# Altium schematic sheet 12_fit_YX.SchDoc
size B; SheetNumber: 1; SheetTotal: 3
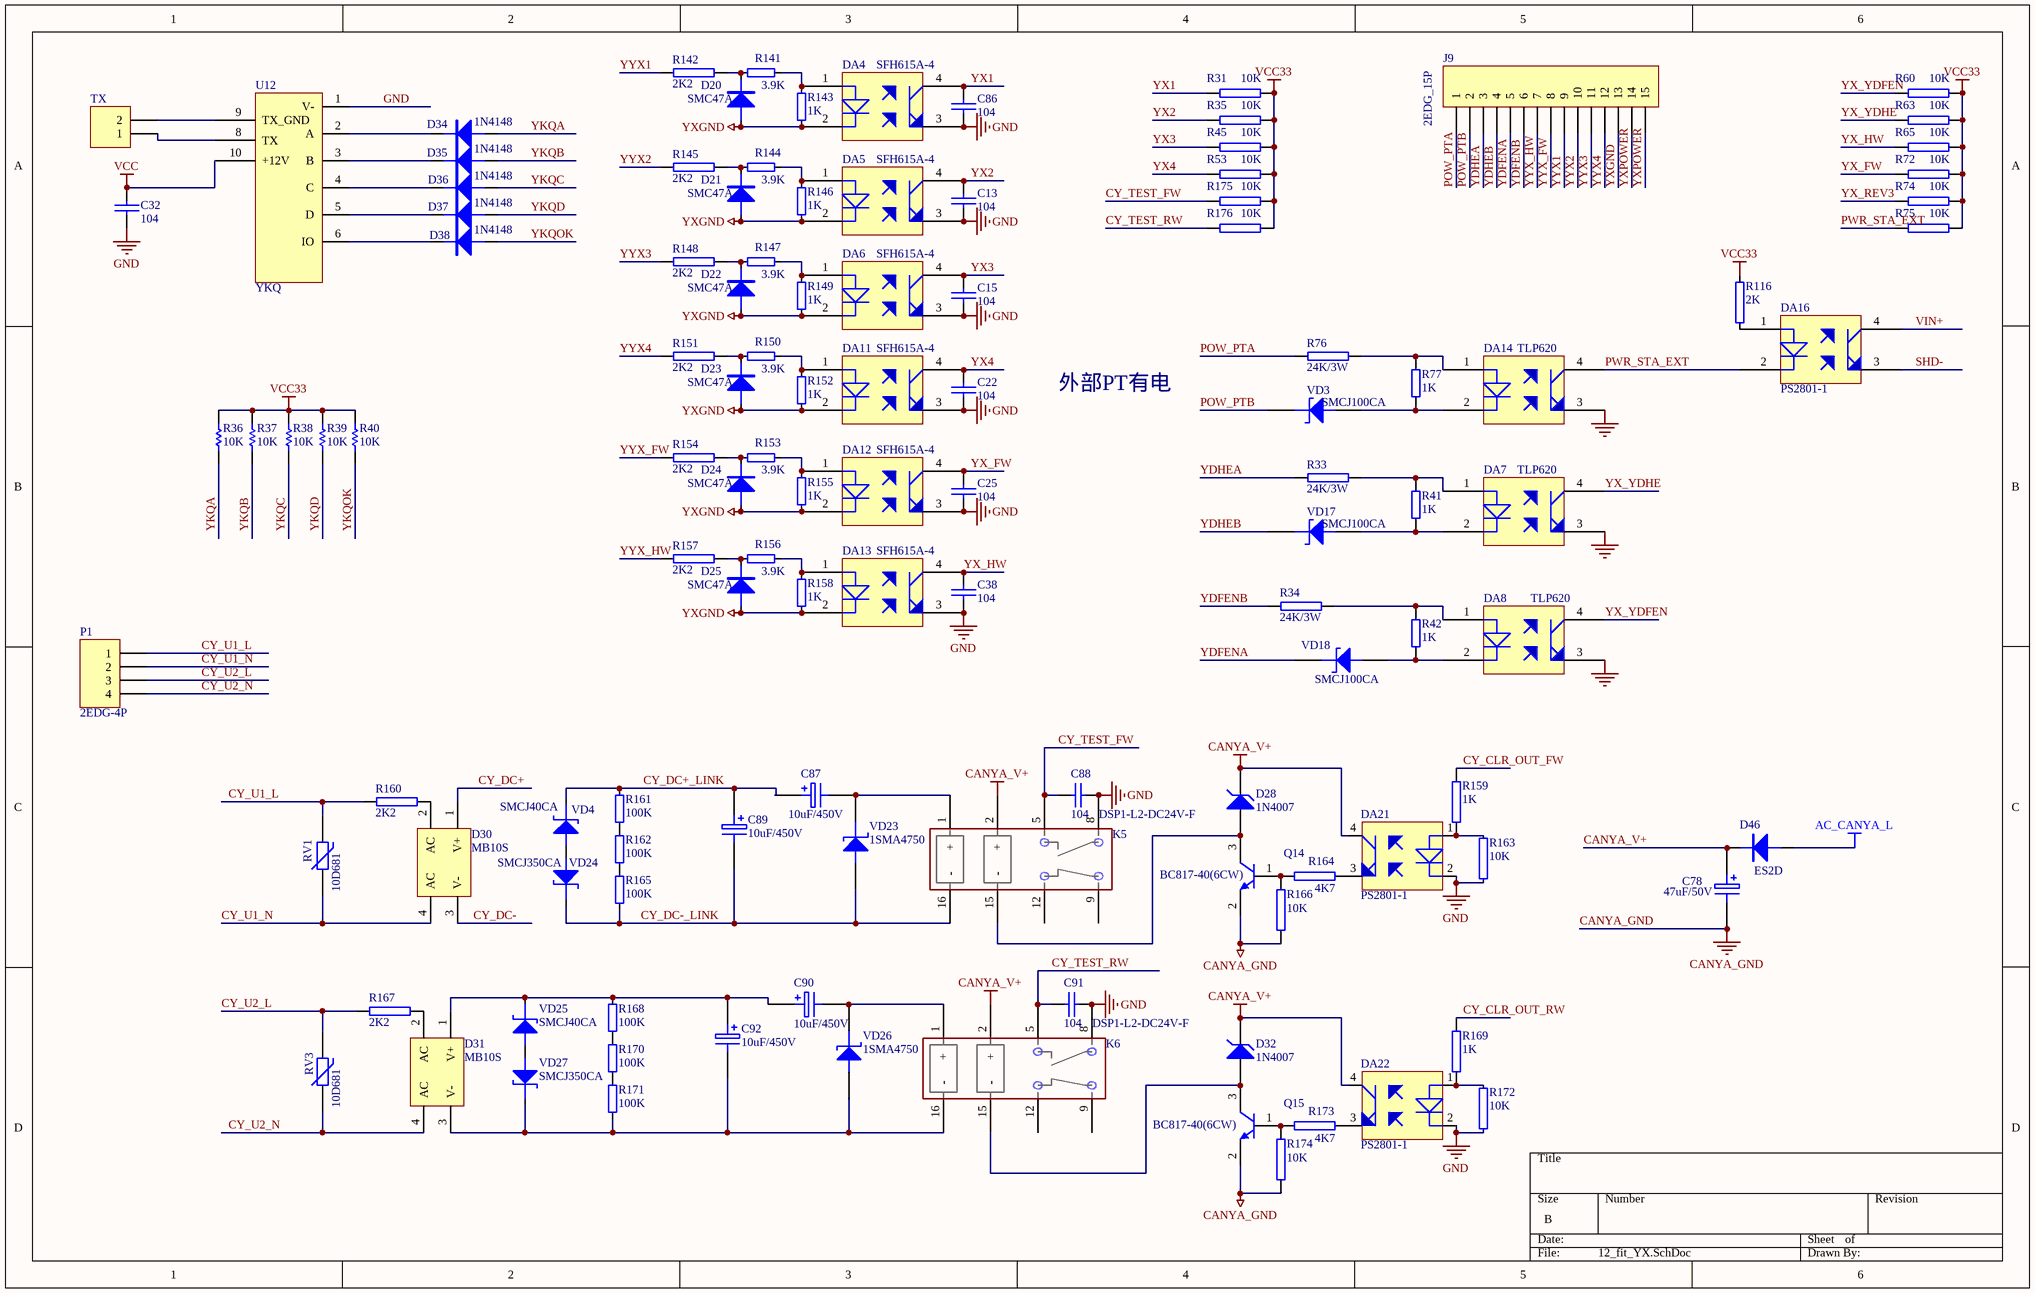
[diagram p0: 12_fit_YX.SchDoc]

## Parts
C13  104  [C1206]
C15  104  [C1206]
C22  104  [C1206]
C25  104  [C1206]
C32  104  [C1206]
C38  104  [C1206]
C78  47uF/50V  [47u/50V]
C86  104  [C1206]
C87  10uF/450V  [10u/450V]
C88  104  [C1206]
C89  10uF/450V  [10u/450V]
C90  10uF/450V  [10u/450V]
C91  104  [C1206]
C92  10uF/450V  [10u/450V]
D20  SMC47A  [DO-214AB]
D21  SMC47A  [DO-214AB]
D22  SMC47A  [DO-214AB]
D23  SMC47A  [DO-214AB]
D24  SMC47A  [DO-214AB]
D25  SMC47A  [DO-214AB]
D28  1N4007  [DO-214AC]
D30  MB10S  [TO-269AA]
D31  MB10S  [TO-269AA]
D32  1N4007  [DO-214AC]
D34  1N4148  [SMT_4148]
D35  1N4148  [SMT_4148]
D36  1N4148  [SMT_4148]
D37  1N4148  [SMT_4148]
D38  1N4148  [SMT_4148]
D46  ES2D  [DO-214AA]
DA4  SFH615A-4  [SFH615A-4]
DA5  SFH615A-4  [SFH615A-4]
DA6  SFH615A-4  [SFH615A-4]
DA7  TLP620  [dip4]
DA8  TLP620  [dip4]
DA11  SFH615A-4  [SFH615A-4]
DA12  SFH615A-4  [SFH615A-4]
DA13  SFH615A-4  [SFH615A-4]
DA14  TLP620  [dip4]
DA16  PS2801-1  [SO-4]
DA21  PS2801-1  [SO-4]
DA22  PS2801-1  [SO-4]
J9  2EDG_15P  [XR_POWER5.08_15_弯]
K5  DSP1-L2-DC24V-F  [DSP1-L2-DC24V-F]
K6  DSP1-L2-DC24V-F  [DSP1-L2-DC24V-F]
P1  2EDG-4P  [XR_POWER5.08_4_弯]
Q14  BC817-40(6CW)  [SOT-23]
Q15  BC817-40(6CW)  [SOT-23]
R31  10K  [R1206]
R33  24K/3W  [res-l5]
R34  24K/3W  [res-l5]
R35  10K  [R1206]
R36  10K  [R1206]
R37  10K  [R1206]
R38  10K  [R1206]
R39  10K  [R1206]
R40  10K  [R1206]
R41  1K  [R1206]
R42  1K  [R1206]
R45  10K  [R1206]
R53  10K  [R1206]
R60  10K  [R1206]
R63  10K  [R1206]
R65  10K  [R1206]
R72  10K  [R1206]
R74  10K  [R1206]
R75  10K  [R1206]
R76  24K/3W  [res-l5]
R77  1K  [R1206]
R116  2K  [R1206]
R141  3.9K  [R1206]
R142  2K2  [res_0.5W-L-5.08]
R143  1K  [R1206]
R144  3.9K  [R1206]
R145  2K2  [res_0.5W-L-5.08]
R146  1K  [R1206]
R147  3.9K  [R1206]
R148  2K2  [res_0.5W-L-5.08]
R149  1K  [R1206]
R150  3.9K  [R1206]
R151  2K2  [res_0.5W-L-5.08]
R152  1K  [R1206]
R153  3.9K  [R1206]
R154  2K2  [res_0.5W-L-5.08]
R155  1K  [R1206]
R156  3.9K  [R1206]
R157  2K2  [res_0.5W-L-5.08]
R158  1K  [R1206]
R159  1K  [R1206]
R160  2K2  [res_0.5W-L-5.08]
R161  100K  [R1206]
R162  100K  [R1206]
R163  10K  [R1206]
R164  4K7  [R1206]
R165  100K  [R1206]
R166  10K  [R1206]
R167  2K2  [res_0.5W-L-5.08]
R168  100K  [R1206]
R169  1K  [R1206]
R170  100K  [R1206]
R171  100K  [R1206]
R172  10K  [R1206]
R173  4K7  [R1206]
R174  10K  [R1206]
R175  10K  [R1206]
R176  10K  [R1206]
RV1  10D681  [NTC]
RV3  10D681  [NTC]
TX  (no value)  [XH_2.54*2]
U12  YKQ  [YKQ]
VD3  SMCJ100CA  [DO-214AB]
VD4  SMCJ40CA  [DO-214AB]
VD17  SMCJ100CA  [DO-214AB]
VD18  SMCJ100CA  [DO-214AB]
VD23  1SMA4750  [DO-214AC]
VD24  SMCJ350CA  [DO-214AB]
VD25  SMCJ40CA  [DO-214AB]
VD26  1SMA4750  [DO-214AC]
VD27  SMCJ350CA  [DO-214AB]

## Nets
AC_CANYA_L: D46.1(A)
CANYA_GND: C78.2 Q14.2(E) Q15.2(E) R166.1 R174.1
CANYA_V+: C78.1 D28.2(K) D32.2(K) D46.2(K) DA21.4 DA22.4 K5.2(+) K6.2(+)
GND: C13.1 C15.1 C22.1 C25.1 C32.1 C38.1 C86.1 C88.1 C91.1 DA4.3 DA5.3 DA6.3 DA7.3 DA8.3 DA11.3 DA12.3 DA13.3 DA14.3 DA21.2 DA22.2 K5.8(NO_COM) K6.8(NO_COM) R163.1 R172.1 U12.1(V-)
VCC: C32.2 U12.10(+12V)
VCC33: R31.2 R35.2 R36.1 R37.2 R38.2 R39.2 R40.2 R45.2 R53.2 R60.2 R63.2 R65.2 R72.2 R74.2 R75.2 R116.1 R175.2 R176.2
YXGND: D20.1(A) D21.1(A) D22.1(A) D23.1(A) D24.1(A) D25.1(A) DA4.2 DA5.2 DA6.2 DA11.2 DA12.2 DA13.2 J9.13 R143.2 R146.2 R149.2 R152.2 R155.2 R158.2
CY_CLR_OUT_FW: R159.2
CY_CLR_OUT_RW: R169.2
CY_DC+: D30.1(V+)
CY_DC+_LINK: C87.1 C89.1 R161.2 VD4.2(K)
CY_DC-: D30.3(V-)
CY_DC-_LINK: C89.2 K5.16(-) R165.1 VD23.1(A) VD24.2(K)
CY_TEST_FW: C88.2 K5.5(NO) R175.1
CY_TEST_RW: C91.2 K6.5(NO) R176.1
CY_U1_L: P1.1 R160.1 RV1.2
CY_U1_N: D30.4(AC) P1.2 RV1.1
CY_U2_L: P1.3 R167.1 RV3.2
CY_U2_N: D31.4(AC) P1.4 RV3.1
POW_PTA: J9.1 R76.1
POW_PTB: J9.2 VD3.2(K)
PWR_STA_EXT: DA14.4 DA16.2 R75.1
SHD-: DA16.3
VIN+: DA16.4
YDFENA: J9.5 VD18.2(K)
YDFENB: J9.6 R34.1
YDHEA: J9.3 R33.1
YDHEB: J9.4 VD17.2(K)
YKQA: D34.1(A) R36.2
YKQB: D35.1(A) R37.1
YKQC: D36.1(A) R38.1
YKQD: D37.1(A) R39.1
YKQOK: D38.1(A) R40.1
YX1: C86.2 DA4.4 R31.1
YX2: C13.2 DA5.4 R35.1
YX3: C15.2 DA6.4 R45.1
YX4: C22.2 DA11.4 R53.1
YX_FW: C25.2 DA12.4 R72.1
YX_HW: C38.2 DA13.4 R65.1
YX_REV3: R74.1
YX_YDFEN: DA8.4 R60.1
YX_YDHE: DA7.4 R63.1
YXPOWER: J9.14 J9.15
YYX1: J9.9 R142.1
YYX2: J9.10 R145.1
YYX3: J9.11 R148.1
YYX4: J9.12 R151.1
YYX_FW: J9.8 R154.1
YYX_HW: J9.7 R157.1
NetC87_2: C87.2 K5.1(+) VD23.2(K)
NetC90_1: C90.1 C92.1 D31.1(V+) R168.2 VD25.2(K)
NetC90_2: C90.2 K6.1(+) VD26.2(K)
NetC92_2: C92.2 D31.3(V-) K6.16(-) R171.1 VD26.1(A) VD27.2(K)
NetD20_2: D20.2(K) R141.1 R142.2
NetD21_2: D21.2(K) R144.1 R145.2
NetD22_2: D22.2(K) R147.1 R148.2
NetD23_2: D23.2(K) R150.1 R151.2
NetD24_2: D24.2(K) R153.1 R154.2
NetD25_2: D25.2(K) R156.1 R157.2
NetD28_1: D28.1(A) K5.15(-) Q14.3(C)
NetD30_2: D30.2(AC) R160.2
NetD31_2: D31.2(AC) R167.2
NetD32_1: D32.1(A) K6.15(-) Q15.3(C)
NetD34_2: D34.2(K) U12.2(A)
NetD35_2: D35.2(K) U12.3(B)
NetD36_2: D36.2(K) U12.4(C)
NetD37_2: D37.2(K) U12.5(D)
NetD38_2: D38.2(K) U12.6(IO)
NetDA4_1: DA4.1 R141.2 R143.1
NetDA5_1: DA5.1 R144.2 R146.1
NetDA6_1: DA6.1 R147.2 R149.1
NetDA7_1: DA7.1 R33.2 R41.1
NetDA7_2: DA7.2 R41.2 VD17.1(A)
NetDA8_1: DA8.1 R34.2 R42.2
NetDA8_2: DA8.2 R42.1 VD18.1(A)
NetDA11_1: DA11.1 R150.2 R152.1
NetDA12_1: DA12.1 R153.2 R155.1
NetDA13_1: DA13.1 R156.2 R158.1
NetDA14_1: DA14.1 R76.2 R77.1
NetDA14_2: DA14.2 R77.2 VD3.1(A)
NetDA16_1: DA16.1 R116.2
NetDA21_1: DA21.1 R159.1 R163.2
NetDA21_3: DA21.3 R164.1
NetDA22_1: DA22.1 R169.1 R172.2
NetDA22_3: DA22.3 R173.1
NetQ14_1: Q14.1(B) R164.2 R166.2
NetQ15_1: Q15.1(B) R173.2 R174.2
NetR161_1: R161.1 R162.2
NetR162_1: R162.1 R165.2
NetR168_1: R168.1 R170.2
NetR170_1: R170.1 R171.2
NetTX_1: TX.1 U12.8(TX)
NetTX_2: TX.2 U12.9(TX_GND)
NetVD4_1: VD4.1(A) VD24.1(A)
NetVD25_1: VD25.1(A) VD27.1(A)

Not connected (* = marked no-connect by the designer): K5 9(NC_COM) 12(NC); K6 9(NC_COM) 12(NC)

## Notes on the sheet
- 外部PT有电

## Library data of the parts
C13 C15 C22 C25 C32 C38 C86 C88 C91 = CAP
C78 C87 C89 C90 C92 = ELECTRO1: Electrolytic Capacitor
D20-D25 D34-D38 D46 = DIODE
D28 D32 = D Zener: Zener Diode; Published: 8-Jun-2000; LatestRevisionDate: 17-Jul-2002; LatestRevisionNote: Re-released for DXP Platform.; PackageReference: DIODE-0.7; Publisher: Altium Limited; PackageDescription: Diode, Thru-Hole; 2 Leads; 0.7 in Pin Spacing
D30 D31 = Bridge2: Diode Bridge; Published: 24-Mar-1999; LatestRevisionDate: 17-Jul-2002; LatestRevisionNote: Re-released for DXP Platform.; PackageReference: D-46_6A; Publisher: Altium Limited; PackageDescription: Bridge Rectifier; 4 Terminals; Body 16.8 x 16.8 mm (typ); Pitch 10.67 mm
DA4-DA8 DA11-DA14 DA16 DA21 DA22 = TLP521-1
J9 = Header 15: Header, 15-Pin; LatestRevisionDate: 17-Jul-2002; LatestRevisionNote: Re-released for DXP Platform.; Publisher: Altium Limited
P1 = Header 4: Header, 4-Pin; LatestRevisionDate: 17-Jul-2002; LatestRevisionNote: Re-released for DXP Platform.; Publisher: Altium Limited
Q14 Q15 = SOT-23 2SC3356-T1B-A    S/YS档: NPN; ComponentLink1Description: 供应商链接; ComponentLink1URL: http://www.szlcsc.com/product/details_10189.html; Package: SOT-23; Supplier: LC; SuppliersPartNumber: C9659
R31 R33-R35 R45 R53 R60 R63 R65 R72 R74-R76 R116 R142 R145 R148 R151 R154 R157 R159 R160 R163 R164 R166 R167 R169 R172-R176 = RES2
R36-R40 = Res1: Resistor; Published: 8-Jun-2000; LatestRevisionDate: 17-Jul-2002; LatestRevisionNote: Re-released for DXP Platform.; PackageReference: AXIAL-0.3; Publisher: Altium Limited; PackageDescription: Axial Device, Thru-Hole; 2 Leads; 0.3 in Pin Spacing; Value: 10K
R41 R42 R77 R141 R143 R144 R146 R147 R149 R150 R152 R153 R155 R156 R158 R161 R162 R165 R168 R170 R171 = RES
RV1 RV3 = VARISTOR
TX = Header 2: Header, 2-Pin; LatestRevisionDate: 17-Jul-2002; LatestRevisionNote: Re-released for DXP Platform.; Publisher: Altium Limited
U12 = ZENER3_1: Zener Diode
VD3 VD17 = ZENER2: 双向TVS
VD4 VD18 VD23-VD27 = ZENER2: Zener Diode